# Altium schematic sheet SHT-BREAD.SchDoc
size A4
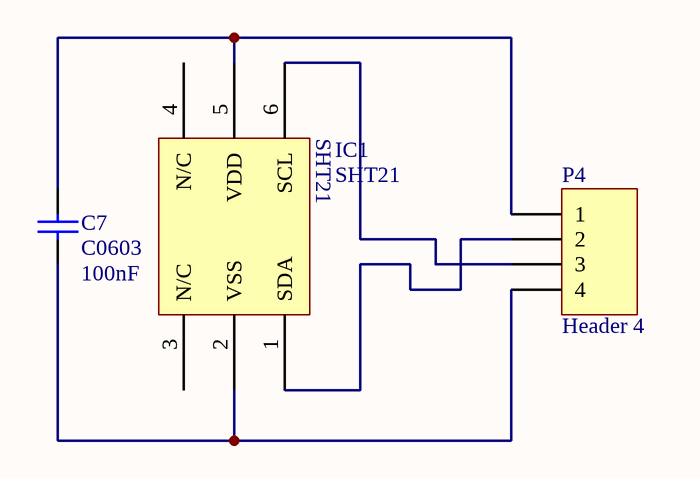
[diagram p0: SHT-BREAD.SchDoc]

## Parts
C7  C0603  value 100nF  [0603]
IC1  SHT21  [PCBComponent_1]
P4  Header 4  [HDR1X4]

## Nets
NetC7_1: C7.1 IC1.5(VDD) P4.1
NetC7_2: C7.2 IC1.2(VSS) P4.4
NetIC1_1: IC1.1(SDA) P4.2
NetIC1_6: IC1.6(SCL) P4.3

Not connected (* = marked no-connect by the designer): IC1 3(N/C) 4(N/C)

## Library data of the parts
C7 = C0603: Ceramic Chip Capacitor - Standard; Note: Footprint corresponds to dimensions for bulk cassette packaging. This case size has tightened tolerances.; Published: 17-Jul-2002; LatestRevisionDate: 19-Mar-2004; LatestRevisionNote: Silkscreen size reduced.; DatasheetDocument: Mar-2001; PackageDocument: Mar-2001; PackageReference: 0603; Publisher: Altium Limited; Code_JEITA: 0603; Code_IPC: 1608 [0603]; ComponentLink1Description: Manufacturer Link; ComponentLink1URL: http://www.kemet.com/; ComponentLink2Description: Datasheet; ComponentLink2URL: http://www.kemet.com/kemet/web/homepage/kechome.nsf/vapubfilesname/F3102TA.pdf/$file/F3102TA.pdf
P4 = Header 4: Header, 4-Pin; LatestRevisionDate: 17-Jul-2002; LatestRevisionNote: Re-released for DXP Platform.; Publisher: Altium Limited